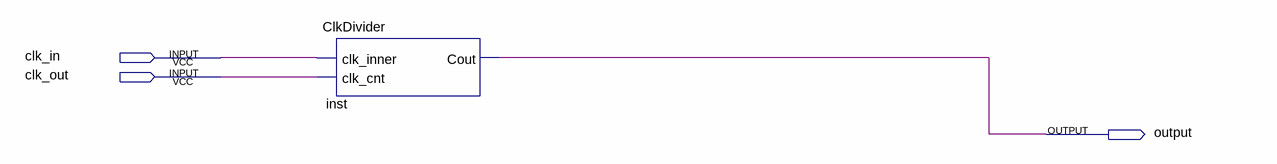
[diagram p0: schematic sheet]
// Quartus schematic lab6.bdf as structural Verilog: 1 symbols, 3 pins
module lab6 (
  input  clk_in,
  input  clk_out,
  output \output 
);

  ClkDivider inst (.clk_inner(clk_in), .clk_cnt(clk_out), .Cout(\output ));
endmodule
